# Altium schematic sheet BU01.SchDoc
size A4
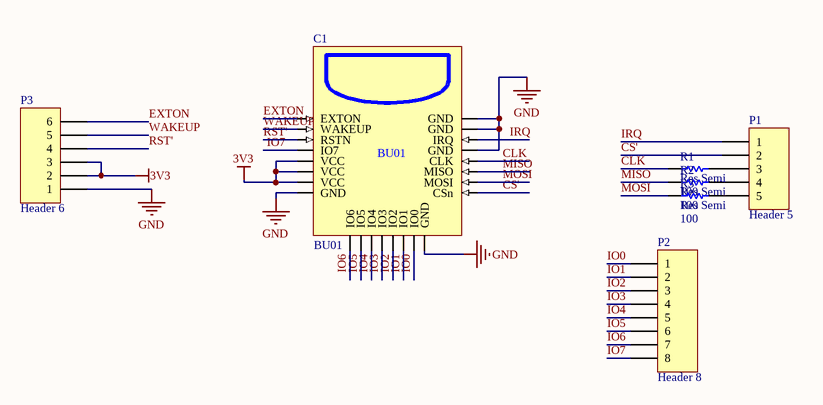
[diagram p0: BU01.SchDoc]

## Parts
C1  BU01  [BU01]
P1  Header 5  [HDR1X5]
P2  Header 8  [HDR1X8]
P3  Header 6  [HDR1X6]
R1  Res Semi  value 100  [0805]
R2  Res Semi  value 100  [0805]
R3  Res Semi  value 100  [0805]

## Nets
3V3: C1.5(VCC) C1.6(VCC) C1.7(VCC) P3.2 P3.3
GND: C1.8(GND) C1.16(GND) C1.21(GND) C1.23(GND) C1.24(GND) P3.1
CLK: C1.20(CLK) R1.1
CS': C1.17(CSn) P1.2
EXTON: C1.1(EXTON) P3.6
IO0: C1.15(IO0) P2.1
IO1: C1.14(IO1) P2.2
IO2: C1.13(IO2) P2.3
IO3: C1.12(IO3) P2.4
IO4: C1.11(IO4) P2.5
IO5: C1.10(IO5) P2.6
IO6: C1.9(IO6) P2.7
IO7: C1.4(IO7) P2.8
IRQ: C1.22(IRQ) P1.1
MISO: C1.19(MISO) R2.1
MOSI: C1.18(MOSI) R3.1
RST': C1.3(RSTN) P3.4
WAKEUP: C1.2(WAKEUP) P3.5
NetP1_3: P1.3 R1.2
NetP1_4: P1.4 R2.2
NetP1_5: P1.5 R3.2

## Library data of the parts
P1 = Header 5: Header, 5-Pin; LatestRevisionDate: 17-Jul-2002; LatestRevisionNote: Re-released for DXP Platform.; Publisher: Altium Limited
P2 = Header 8: Header, 8-Pin; LatestRevisionDate: 17-Jul-2002; LatestRevisionNote: Re-released for DXP Platform.; Publisher: Altium Limited
P3 = Header 6: Header, 6-Pin; LatestRevisionDate: 17-Jul-2002; LatestRevisionNote: Re-released for DXP Platform.; Publisher: Altium Limited
R1-R3 = Res Semi: Semiconductor Resistor; Published: 8-Jun-2000; LatestRevisionDate: 17-Jul-2002; LatestRevisionNote: Re-released for DXP Platform.; PackageReference: AXIAL-0.5; Publisher: Altium Limited; PackageDescription: Axial Device, Thru-Hole; 2 Leads; 0.5 in Pin Spacing